# EAGLE design w2aew (EAGLE 6.6.0)
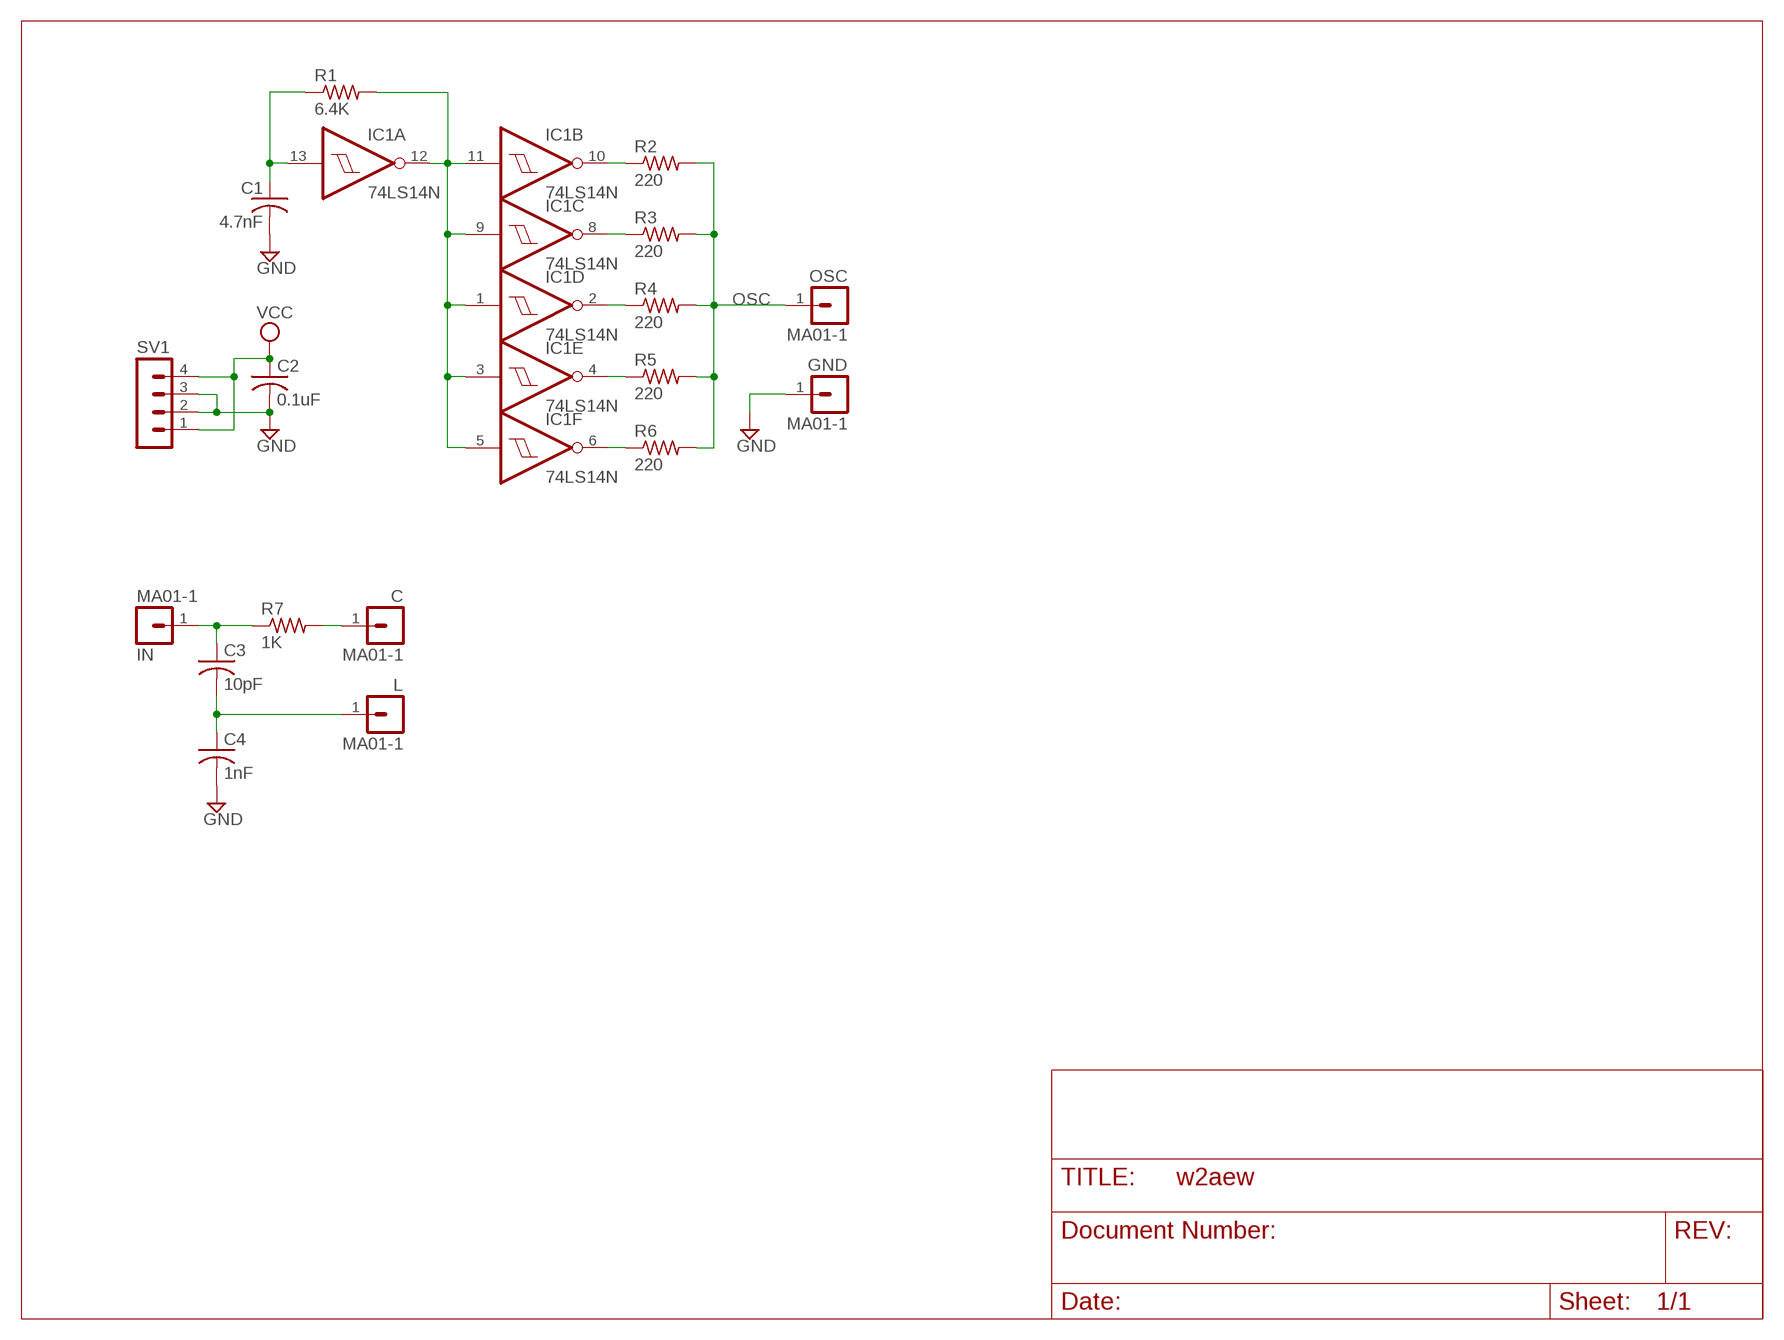
[diagram p0: schematic, sheet 1]

## Parts
C  MA01-1  [MA01-1]
C1  4.7nF  C-US050-025X075  [C050-025X075]
C2  0.1uF  C-US050-025X075  [C050-025X075]
C3  10pF  C-US050-025X075  [C050-025X075]
C4  1nF  C-US050-025X075  [C050-025X075]
GND  MA01-1  [MA01-1]
IC1  74LS14N  [DIL14]
IN  MA01-1  [MA01-1]
L  MA01-1  [MA01-1]
OSC  MA01-1  [MA01-1]
R1  6.4K  R-US_0207/10  [0207/10]
R2  220  R-US_0207/10  [0207/10]
R3  220  R-US_0207/10  [0207/10]
R4  220  R-US_0207/10  [0207/10]
R5  220  R-US_0207/10  [0207/10]
R6  220  R-US_0207/10  [0207/10]
R7  1K  R-US_0207/10  [0207/10]
SV1  MA04-1  [MA04-1]

## Nets
GND: C1.2 C2.2 C4.2 GND.1 SV1.2 SV1.3
N$1: C1.1 IC1.13(A:I) R1.1
N$2: IC1.1(D:I) IC1.3(E:I) IC1.5(F:I) IC1.9(C:I) IC1.11(B:I) IC1.12(A:O) R1.2
N$3: IC1.10(B:O) R2.1
N$4: IC1.8(C:O) R3.1
N$5: IC1.2(D:O) R4.1
N$6: IC1.4(E:O) R5.1
N$7: IC1.6(F:O) R6.1
N$8: C3.1 IN.1 R7.1
N$9: C.1 R7.2
N$10: C3.2 C4.1 L.1
OSC: OSC.1 R2.2 R3.2 R4.2 R5.2 R6.2
VCC: C2.1 SV1.1 SV1.4

## Power pins joined to a net without a drawn wire
GND: IC1.7(P:GND)
VCC: IC1.14(P:VCC)

## Library data of the parts
C GND IN L OSC = dec-con:MA01-1: Pin Header (.125" spacing)
C1-C4 = rcl:C-US: CAPACITOR, American symbol
IC1 = 74xx-us:74*14: Hex schmitt trigger INVERTER
R1-R7 = rcl:R-US_: RESISTOR, American symbol
SV1 = con-lstb:MA04-1: PIN HEADER; OC_FARNELL: unknown; OC_NEWARK: unknown

## Board
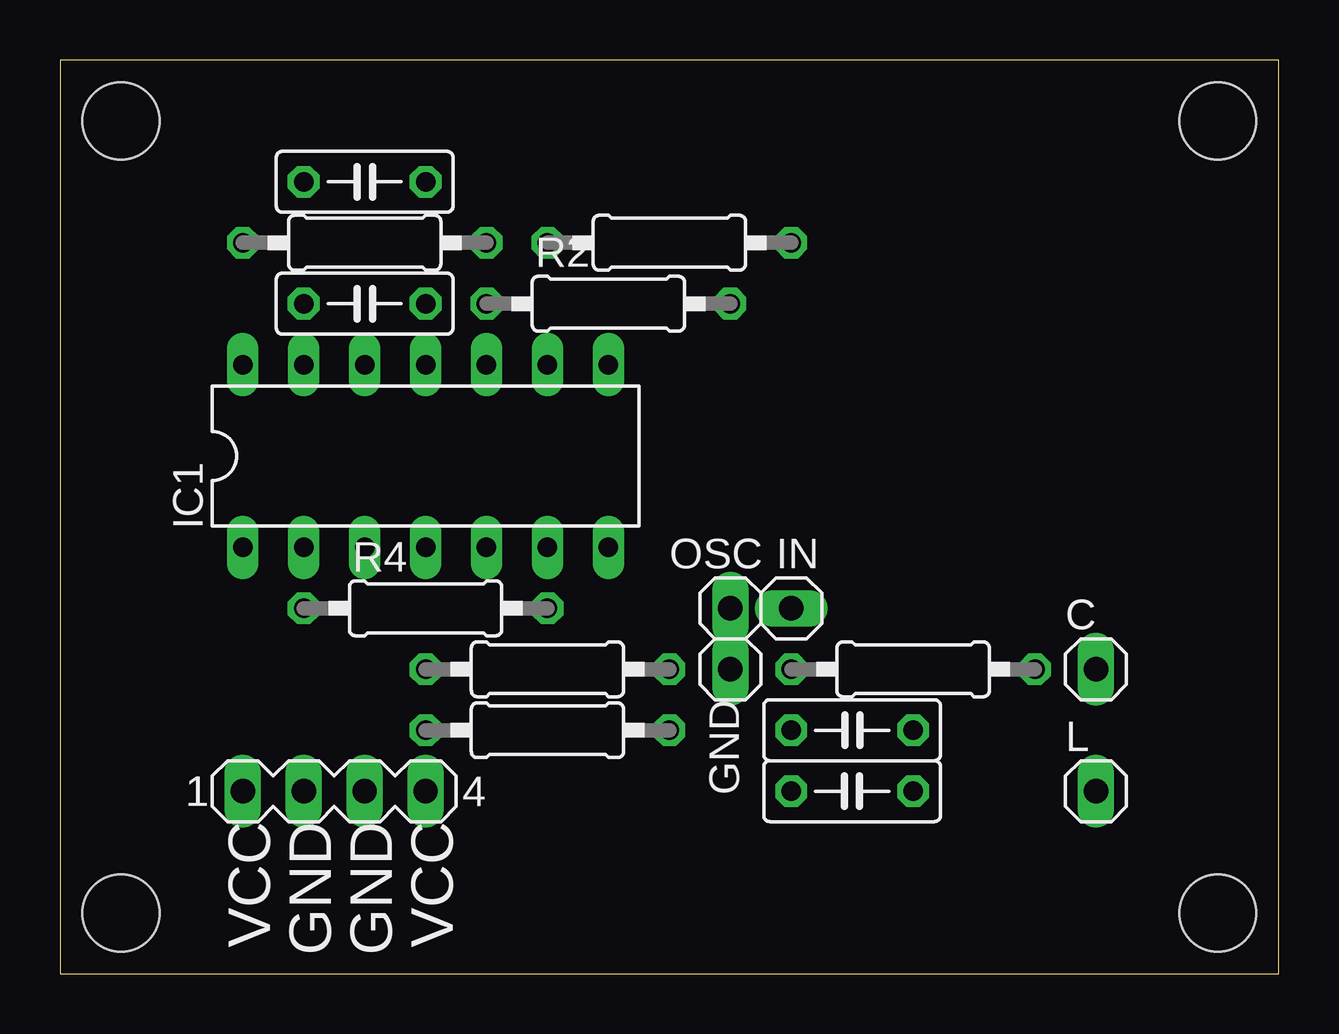
[diagram p1: board, top side]
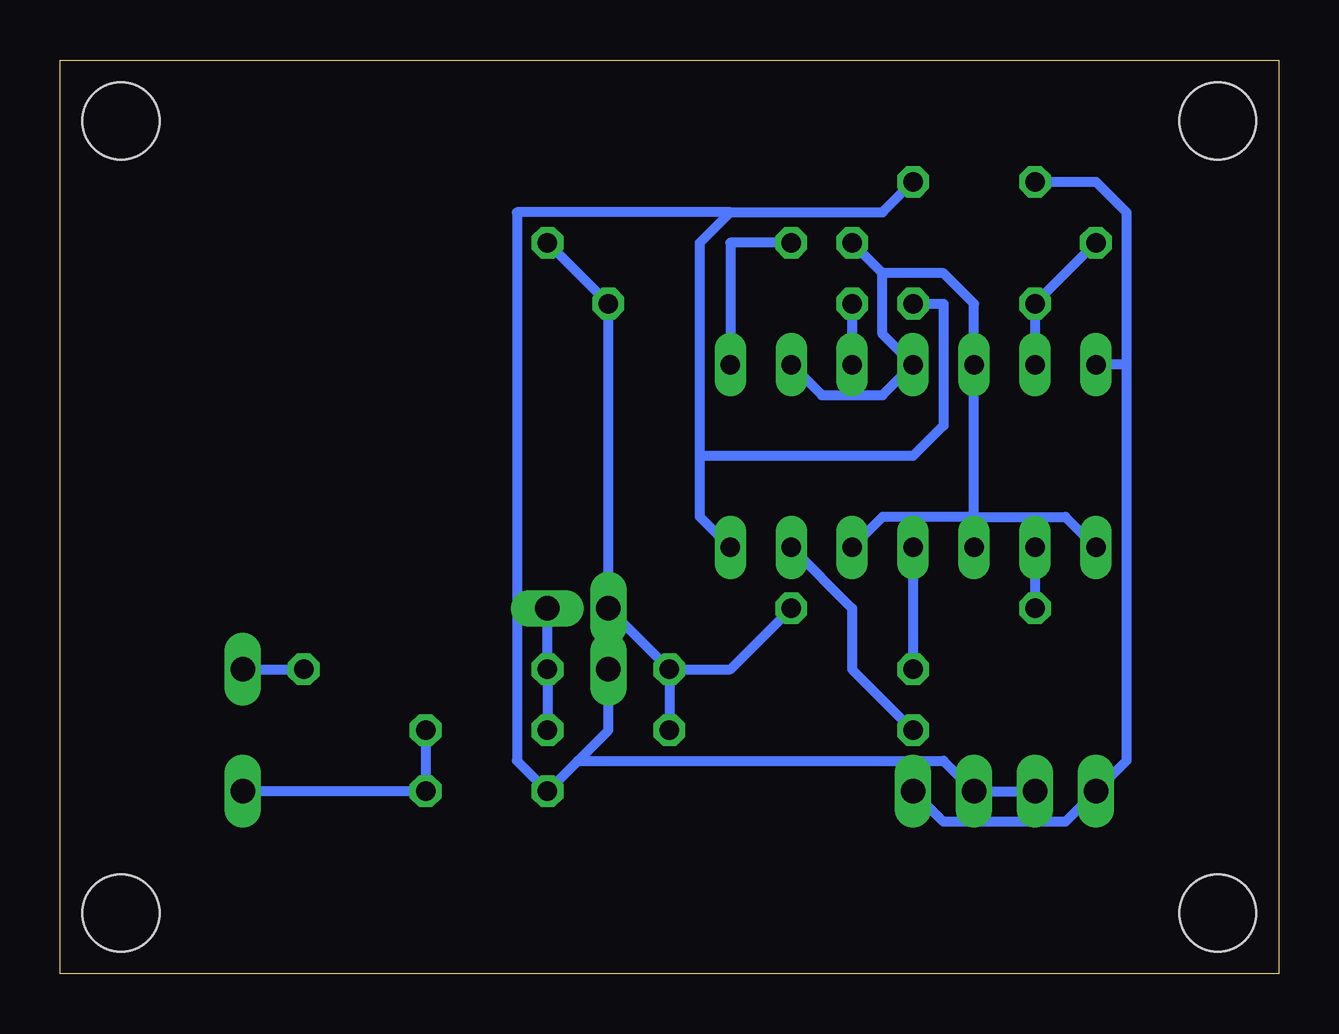
[diagram p2: board, bottom side, seen from below]

Size 50.8 x 38.1 mm. Coordinates in mm from the lower left corner, seen from the top.
Outline: 0,0 50.8,0 50.8,38.1 0,38.1 0,0
Copper layers (1+16): Top 0.035mm / dielectric 1.5mm / Bottom 0.035mm
Design rules "16mils": minimum track width 16mil, minimum drill 32mil, track to track 15mil, track to pad 10mil, pad to pad 10mil, via to via 10mil, smd to smd 10mil, copper to edge 13mil, drill to drill 10mil, minimum pad ring 10mil, minimum via ring 8mil, stop-mask expansion 0mil, vias tented up to drill 0mil, thermal gap 10mil
Holes 3.2 mm at 2.54,2.54 2.54,35.56 48.26,35.56 48.26,2.54

### Footprints (pad centres in the part's own frame; a part is rotated, then mirrored left to right if it is on the bottom)
MA01-1 = drill 1.016 long: 1 0,0
C050-025X075 = drill 0.813 octagon: 1 -2.54,0; 2 2.54,0
DIL14 = drill 0.813 long: 1 -7.62,-3.81; 2 -5.08,-3.81; 3 -2.54,-3.81; 4 0,-3.81; 5 2.54,-3.81; 6 5.08,-3.81; 7 7.62,-3.81; 8 7.62,3.81; 9 5.08,3.81; 10 2.54,3.81; 11 0,3.81; 12 -2.54,3.81; 13 -5.08,3.81; 14 -7.62,3.81
0207/10 = drill 0.813 octagon: 1 -5.08,0; 2 5.08,0
MA04-1 = drill 1.016 long: 1 -3.81,0; 2 -1.27,0; 3 1.27,0; 4 3.81,0

### Placement (x,y rotation side)
C  43.18,12.7 0 top
C1  12.7,27.94 0 top
C2  12.7,33.02 0 top
C3  33.02,10.16 0 top
C4  33.02,7.62 180 top
GND  27.94,12.7 180 top
IC1  15.24,21.59 0 top
IN  30.48,15.24 270 top
L  43.18,7.62 0 top
OSC  27.94,15.24 0 top
R1  12.7,30.48 0 top
R2  22.86,27.94 0 top
R3  25.4,30.48 0 top
R4  15.24,15.24 0 top
R5  20.32,12.7 0 top
R6  20.32,10.16 0 top
R7  35.56,12.7 0 top
SV1  11.43,7.62 0 top

### Tracks (layer width: path | path; a pad name or v marks a point on that pad's centre or on a via)
GND
  Bottom 0.406: SV1.2 SV1.3 13.97,8.89 29.21,8.89 | 29.21,8.89 C4.2 31.75,8.89 31.75,31.75 22.86,31.75 | 29.21,8.89 27.94,10.16 GND.1 | C1.2 13.97,27.94 13.97,22.86 15.24,21.59 24.13,21.59 | C2.2 16.51,31.75 22.86,31.75 | 22.86,31.75 24.13,30.48 24.13,21.59 | IC1.7 24.13,19.05 24.13,21.59
N$1
  Bottom 0.406: IC1.13 C1.1 R1.1
N$2
  Bottom 0.406: 16.51,29.21 R1.2 | 16.51,29.21 16.51,26.67 IC1.11 16.51,24.13 19.05,24.13 IC1.9 | IC1.1 8.89,19.05 12.7,19.05 | IC1.3 12.7,19.05 | 12.7,19.05 IC1.12 12.7,27.94 13.97,29.21 16.51,29.21 | IC1.5 16.51,19.05 12.7,19.05
N$3
  Bottom 0.406: R2.1 IC1.10
N$4
  Bottom 0.406: IC1.8 22.86,30.48 R3.1
N$5
  Bottom 0.406: IC1.2 R4.1
N$6
  Bottom 0.406: IC1.4 R5.1
N$7
  Bottom 0.406: R6.1 17.78,12.7 17.78,15.24 IC1.6
N$8
  Bottom 0.406: C3.1 R7.1 IN.1
N$9
  Bottom 0.406: C.1 R7.2
N$10
  Bottom 0.406: C3.2 C4.1 L.1
OSC
  Bottom 0.406: R3.2 R2.2 OSC.1 R5.2 | R4.2 22.86,12.7 R5.2 | R5.2 R6.2
VCC
  Bottom 0.406: SV1.4 13.97,6.35 8.89,6.35 SV1.1 6.35,8.89 6.35,25.4 | 6.35,25.4 IC1.14 | 6.35,25.4 6.35,31.75 7.62,33.02 C2.1

### Text on the board
tPlace: VCC | GND | GND | VCC